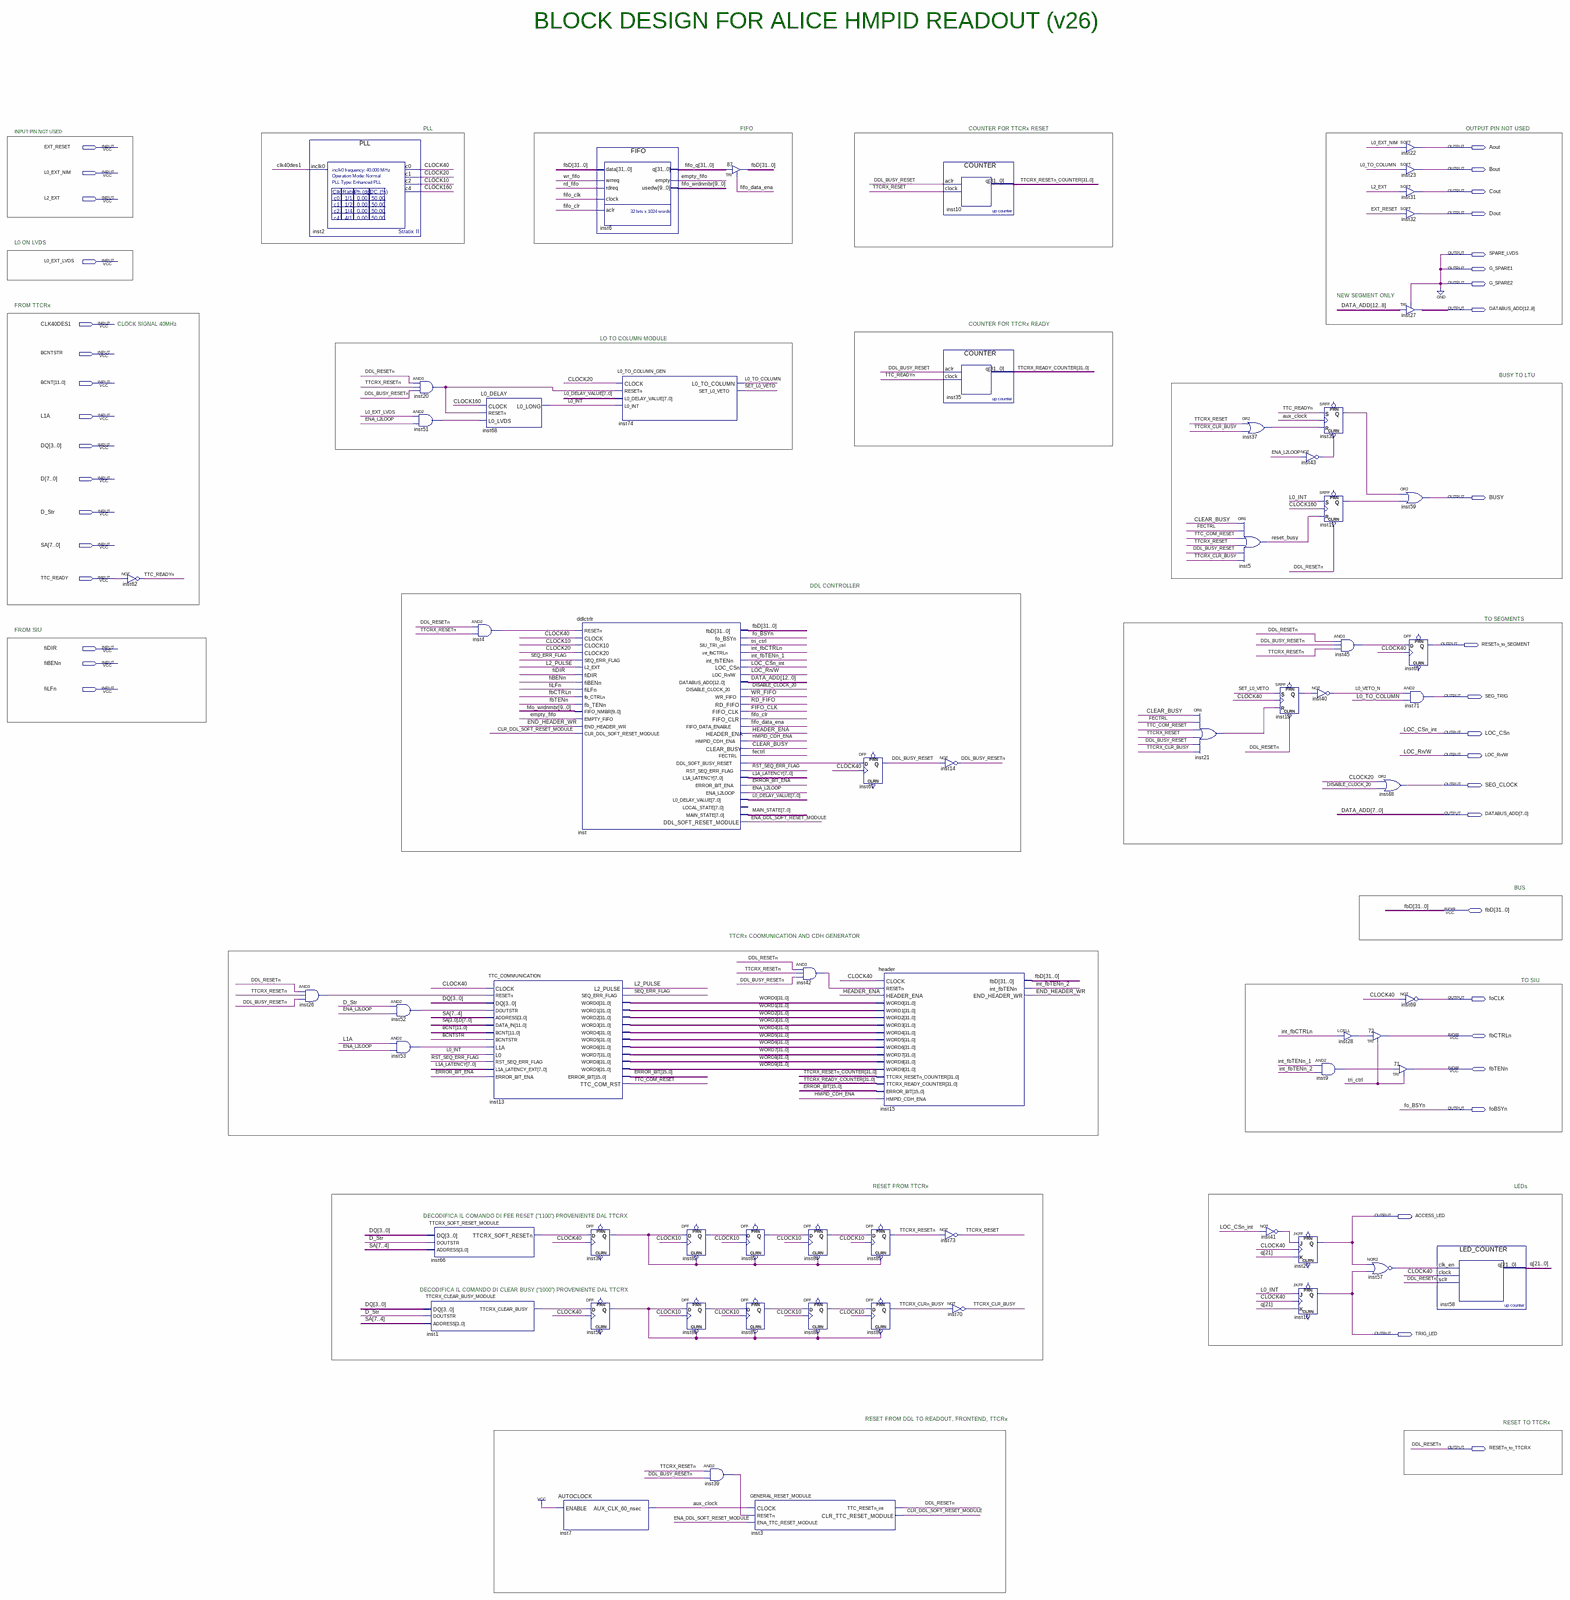
[diagram p0: schematic sheet, whole]
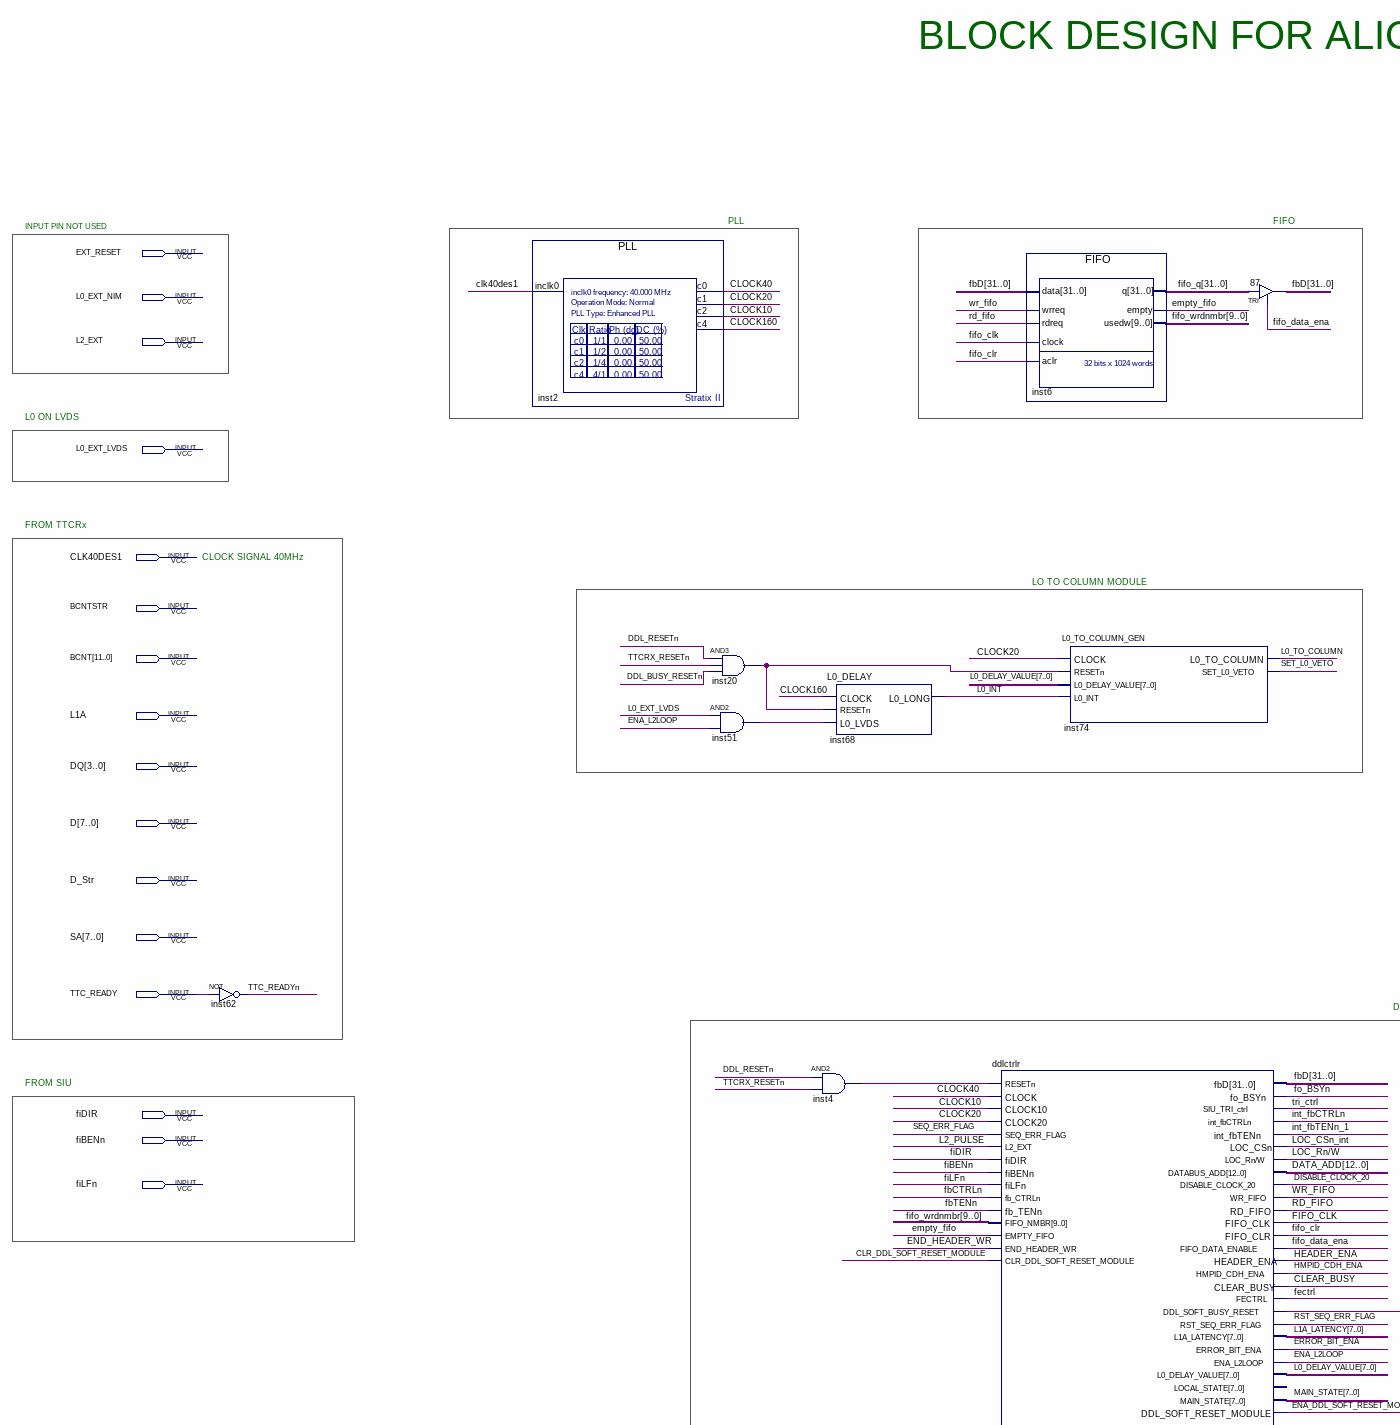
[diagram p1: schematic sheet, upper left part]
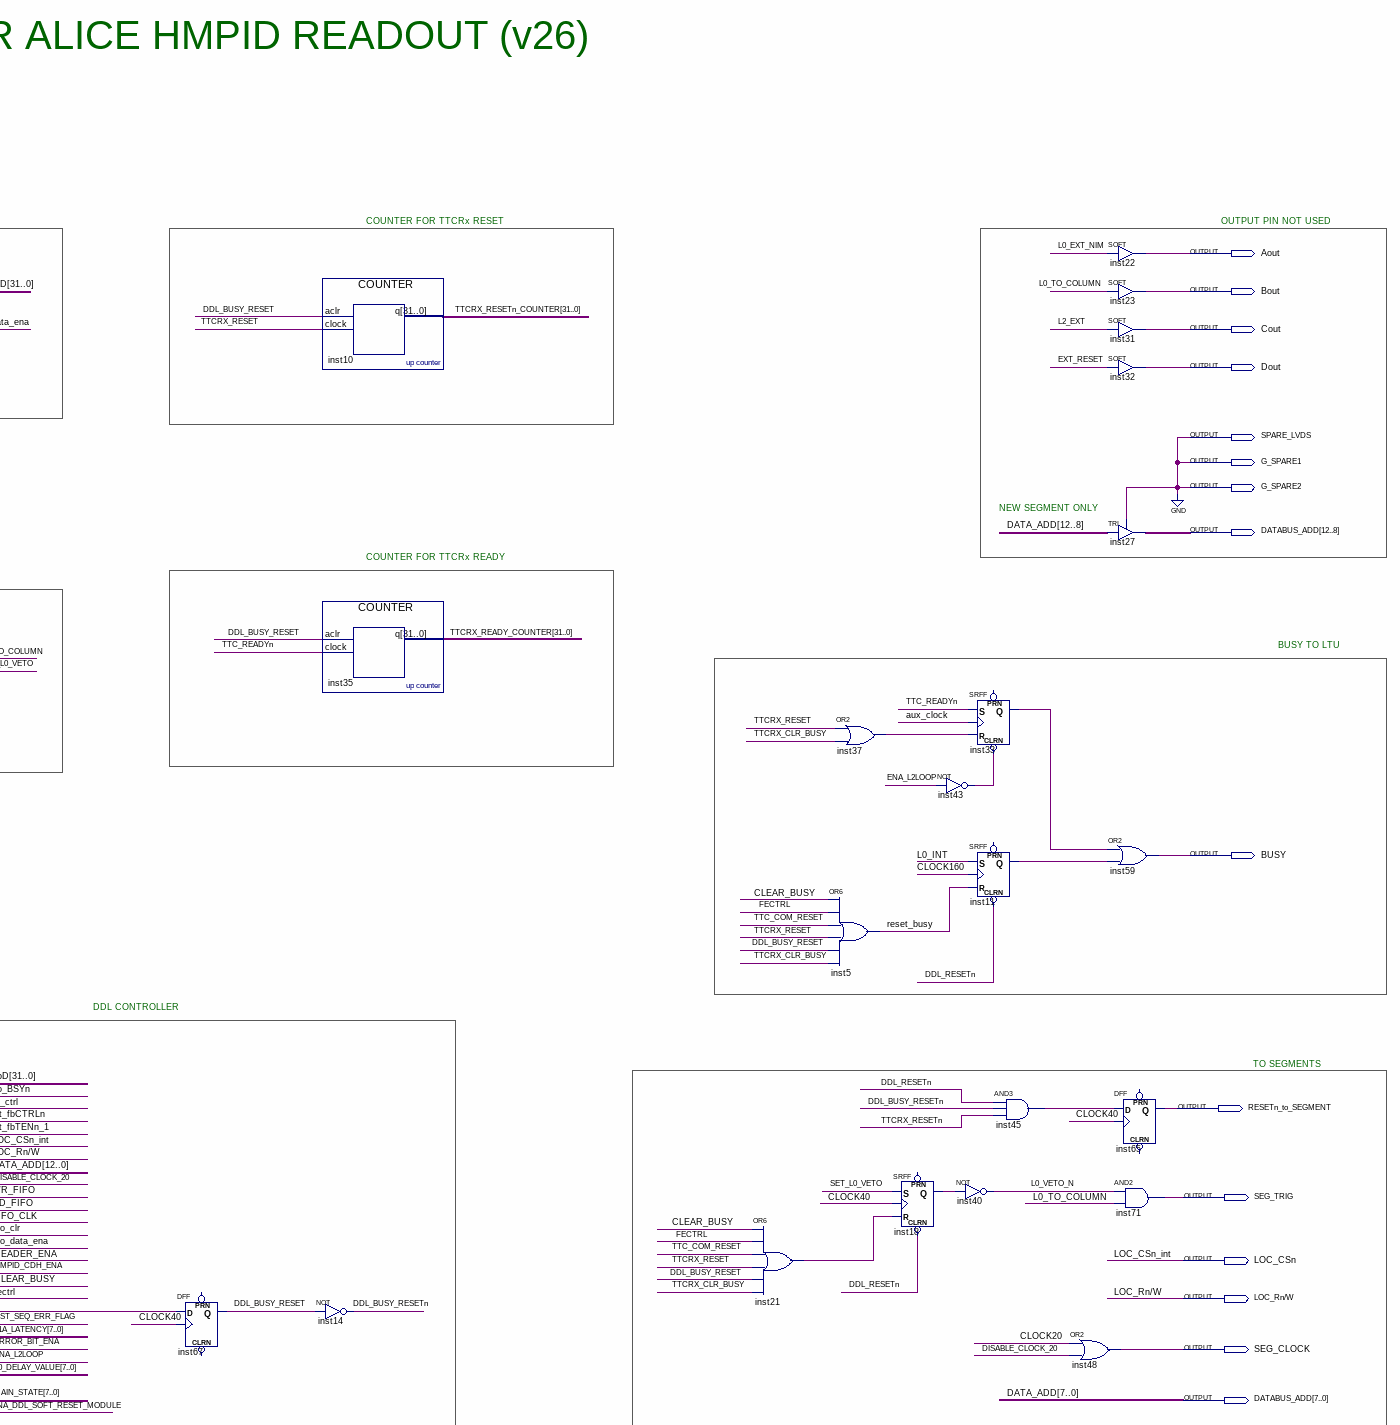
[diagram p2: schematic sheet, upper right part]
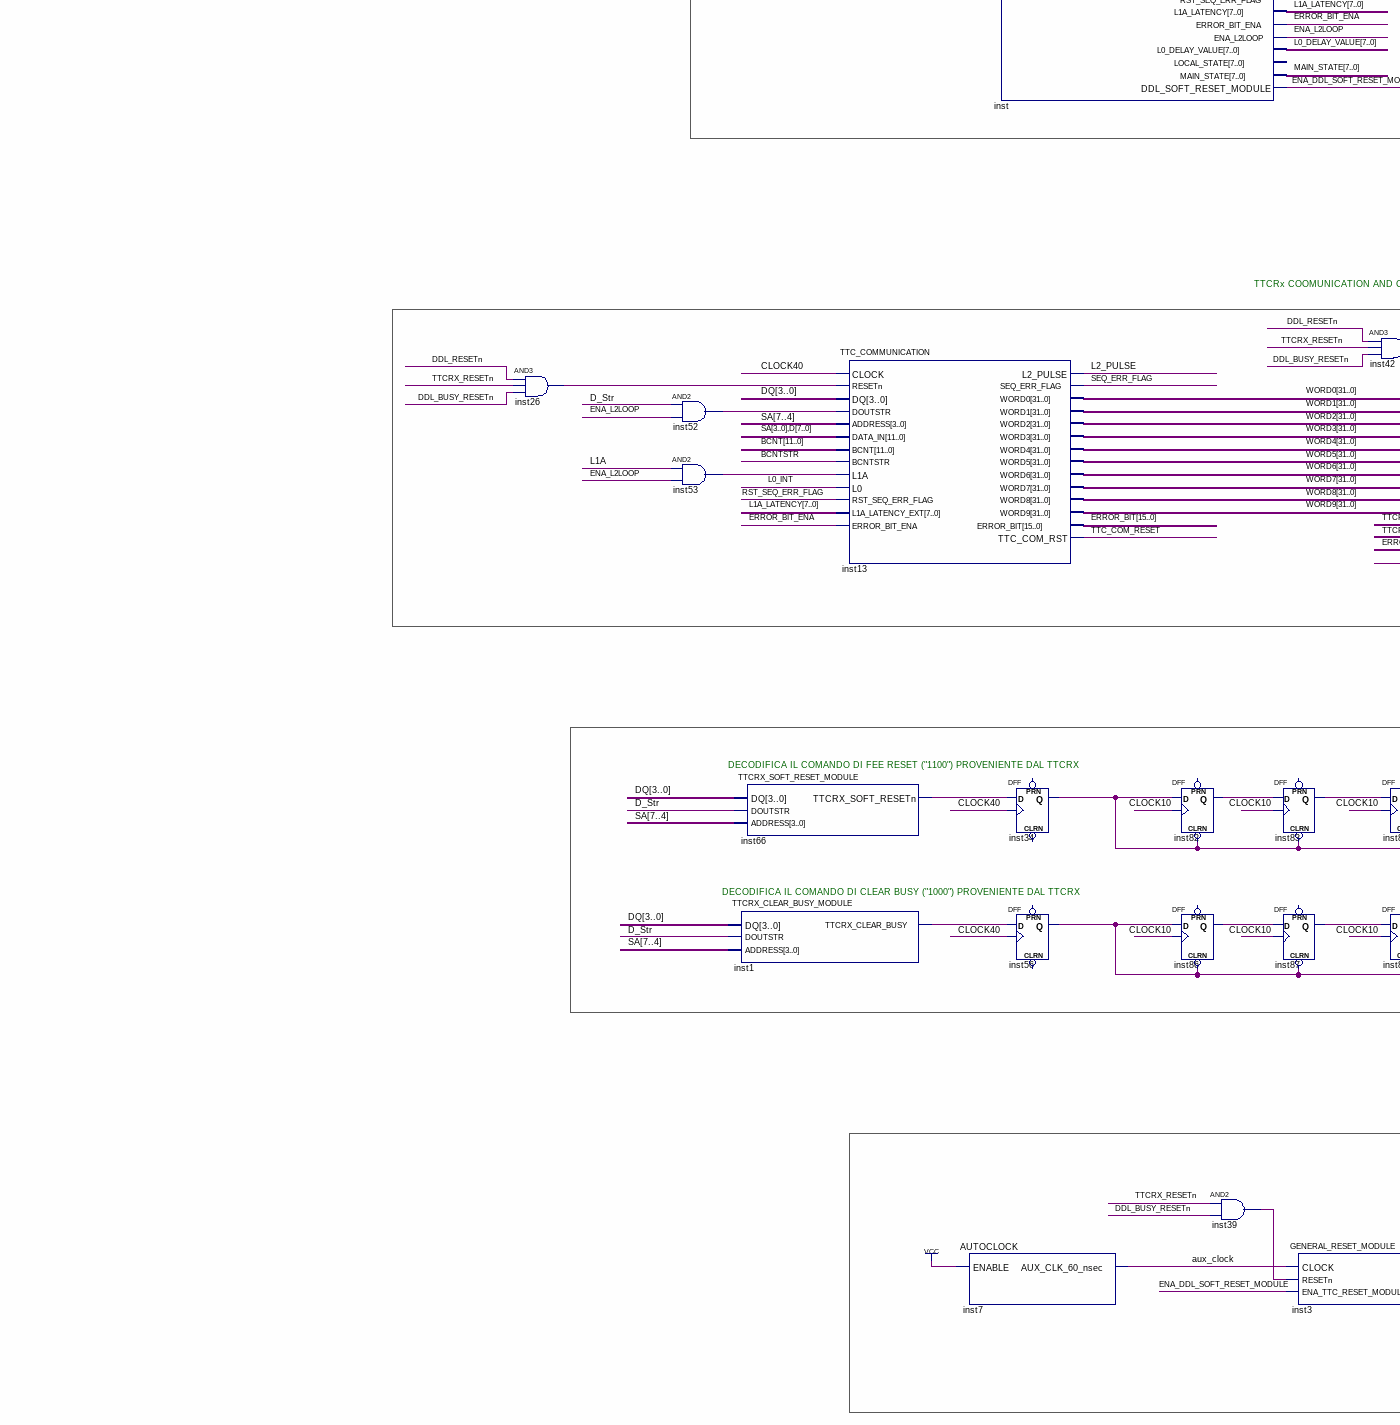
[diagram p3: schematic sheet, lower left part]
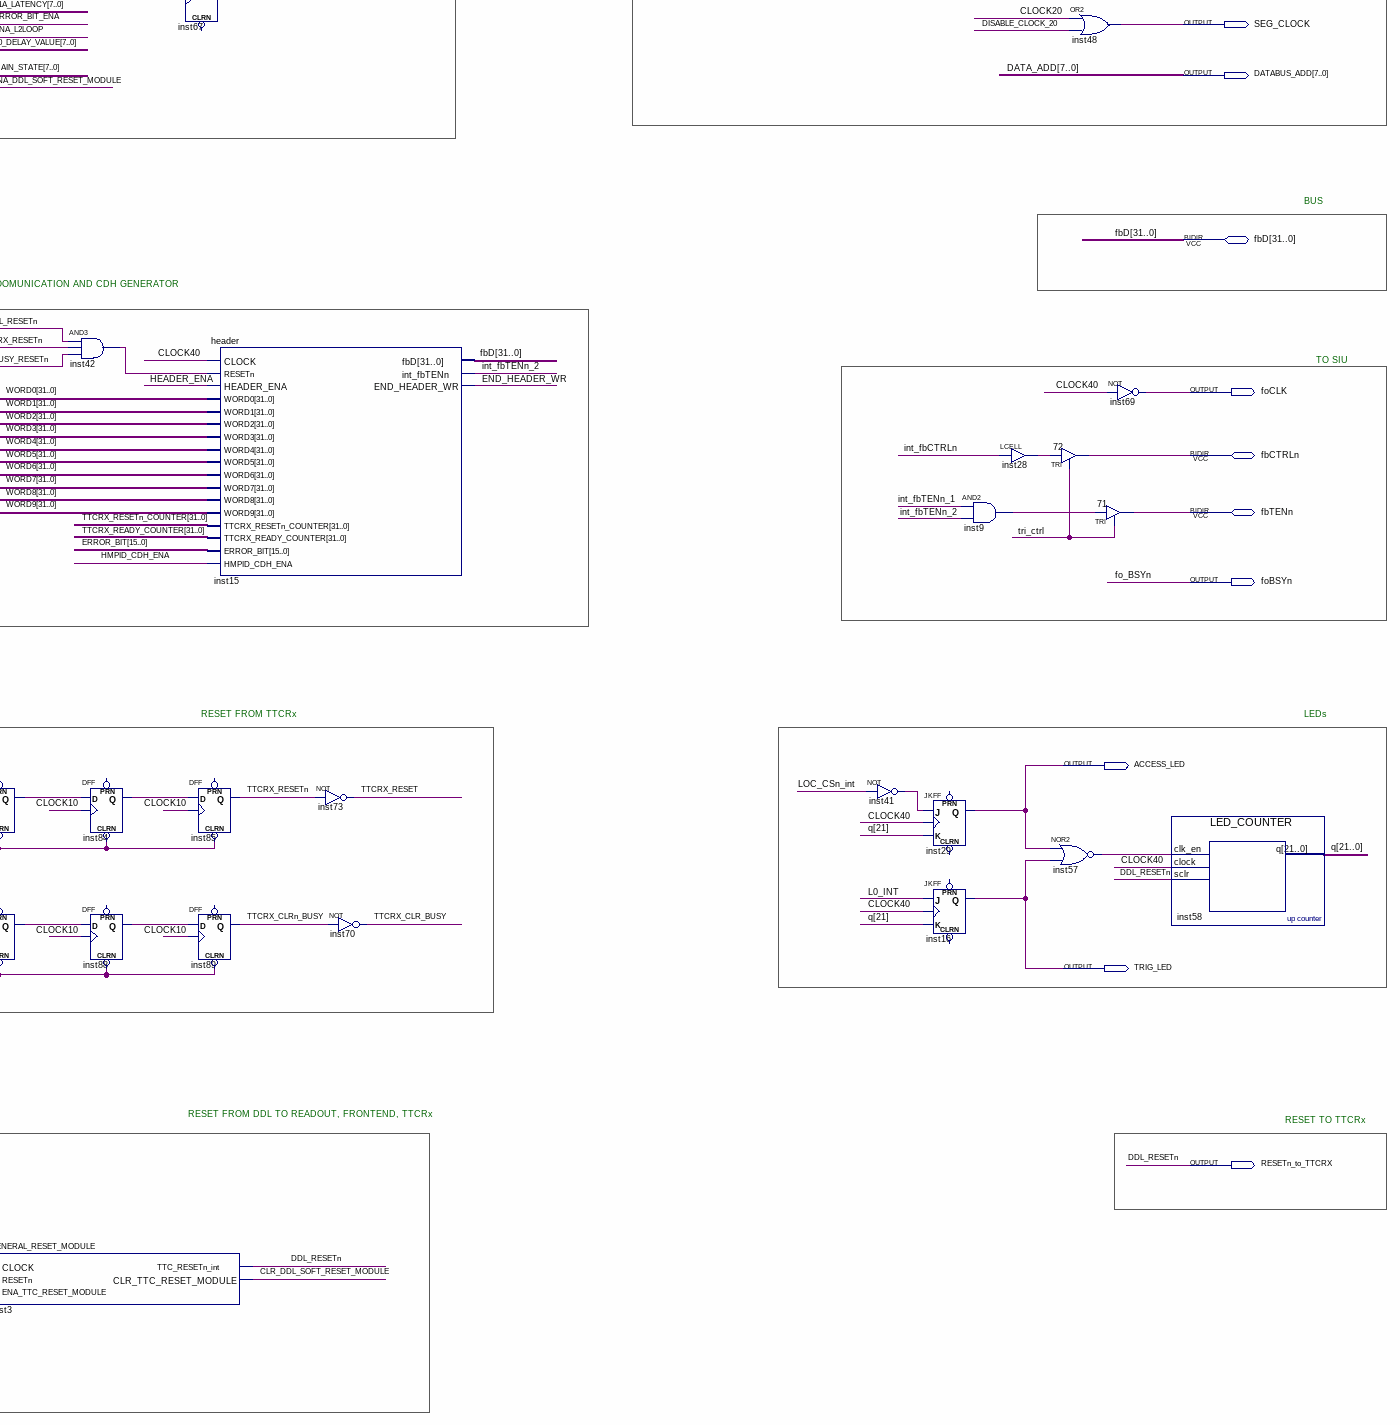
[diagram p4: schematic sheet, lower right part]
// Quartus schematic ddl_ctrlr.bdf as structural Verilog: 65 symbols, 39 pins
module ddl_ctrlr (
  input  EXT_RESET,
  input  L0_EXT_NIM,
  input  L2_EXT,
  input  L0_EXT_LVDS,
  input  CLK40DES1,
  input  BCNTSTR,
  input  [11:0] BCNT,
  input  L1A,
  input  [3:0] DQ,
  input  [7:0] D,
  input  D_Str,
  input  [7:0] SA,
  input  TTC_READY,
  input  fiDIR,
  input  fiBENn,
  input  fiLFn,
  inout  [31:0] fbD,
  inout  fbCTRLn,
  inout  fbTENn,
  output Aout,
  output Bout,
  output Cout,
  output Dout,
  output SPARE_LVDS,
  output G_SPARE1,
  output G_SPARE2,
  output [12:0] DATABUS_ADD,
  output BUSY,
  output RESETn_to_SEGMENT,
  output SEG_TRIG,
  output LOC_CSn,
  output \LOC_Rn/W ,
  output SEG_CLOCK,
  output foCLK,
  output foBSYn,
  output ACCESS_LED,
  output TRIG_LED,
  output RESETn_to_TTCRX
);

  wire aux_clock, CLEAR_BUSY, CLOCK10, CLOCK20, CLOCK40, CLOCK160, CLR_DDL_SOFT_RESET_MODULE, DDL_BUSY_RESET,
       DDL_BUSY_RESETn, DISABLE_CLOCK_20, empty_fifo, ENA_DDL_SOFT_RESET_MODULE, ENA_L2LOOP, END_HEADER_WR,
       ERROR_BIT_ENA, FECTRL, fifo_clk, fifo_clr, fifo_data_ena, HEADER_ENA, HMPID_CDH_ENA,
       inst1_ttcrx_clear_busy, inst4_out, inst9_out, inst11_q, inst18_q, inst20_out, inst21_out, inst26_out,
       inst28_out, inst33_q, inst34_q, inst37_out, inst39_out, inst41_out, inst42_out, inst43_out,
       inst45_out, inst51_out, inst52_out, inst53_out, inst56_q, inst57_out, inst66_ttcrx_soft_resetn,
       inst82_q, inst83_q, inst84_q, inst86_q, inst87_q, inst88_q, inst_ddl_soft_busy_reset, int_fbCTRLn,
       int_fbTENn_1, int_fbTENn_2, L0_INT, L0_TO_COLUMN, L0_VETO_N, L2_PULSE, rd_fifo, reset_busy,
       RST_SEQ_ERR_FLAG, SEQ_ERR_FLAG, SET_L0_VETO, tri_ctrl, TTC_COM_RESET, TTC_READYn, TTCRX_CLR_BUSY,
       TTCRX_CLRn_BUSY, TTCRX_RESET, TTCRX_RESETn, wr_fifo;
  wire [7:0] L0_DELAY_VALUE, L1A_LATENCY, MAIN_STATE;
  wire [9:0] fifo_wrdnmbr;
  wire [12:8] DATA_ADD;
  wire [15:0] ERROR_BIT;
  wire [21:0] q;
  wire [31:0] fifo_q, TTCRX_READY_COUNTER, TTCRX_RESETn_COUNTER, WORD0, WORD1, WORD2, WORD3, WORD4, WORD5,
       WORD6, WORD7, WORD8, WORD9;

  not inst62 (TTC_READYn, TTC_READY);
  PLL inst2 (.inclk0(CLK40DES1), .c0(CLOCK40), .c1(CLOCK20), .c2(CLOCK10), .c4(CLOCK160));
  and inst26 (inst26_out, RESETn_to_TTCRX, TTCRX_RESETn, DDL_BUSY_RESETn);
  and inst20 (inst20_out, RESETn_to_TTCRX, TTCRX_RESETn, DDL_BUSY_RESETn);
  and inst51 (inst51_out, L0_EXT_LVDS, ENA_L2LOOP);
  and inst52 (inst52_out, D_Str, ENA_L2LOOP);
  and inst53 (inst53_out, L1A, ENA_L2LOOP);
  TTCRX_SOFT_RESET_MODULE inst66 (
    .DQ(DQ), .DOUTSTR(D_Str), .ADDRESS(SA[7:4]), .TTCRX_SOFT_RESETn(inst66_ttcrx_soft_resetn));
  TTCRX_CLEAR_BUSY_MODULE inst1 (
    .DQ(DQ), .DOUTSTR(D_Str), .ADDRESS(SA[7:4]), .TTCRX_CLEAR_BUSY(inst1_ttcrx_clear_busy));
  and inst4 (inst4_out, RESETn_to_TTCRX, TTCRX_RESETn);
  L0_DELAY inst68 (.CLOCK(CLOCK160), .RESETn(inst20_out), .L0_LVDS(inst51_out), .L0_LONG(L0_INT));
  TTC_COMMUNICATION inst13 (
    .CLOCK(CLOCK40), .RESETn(inst26_out), .DQ(DQ), .DOUTSTR(inst52_out), .ADDRESS(SA[7:4]),
    .DATA_IN({SA[3:0], D}), .BCNT(BCNT), .BCNTSTR(BCNTSTR), .L1A(inst53_out), .L0(L0_INT),
    .RST_SEQ_ERR_FLAG(RST_SEQ_ERR_FLAG), .L1A_LATENCY_EXT(L1A_LATENCY), .ERROR_BIT_ENA(ERROR_BIT_ENA),
    .L2_PULSE(L2_PULSE), .SEQ_ERR_FLAG(SEQ_ERR_FLAG), .WORD0(WORD0), .WORD1(WORD1), .WORD2(WORD2),
    .WORD3(WORD3), .WORD4(WORD4), .WORD5(WORD5), .WORD6(WORD6), .WORD7(WORD7), .WORD8(WORD8), .WORD9(WORD9),
    .ERROR_BIT(ERROR_BIT), .TTC_COM_RST(TTC_COM_RESET));
  AUTOCLOCK inst7 (.ENABLE(1'b1), .AUX_CLK_60_nsec(aux_clock));
  ddlctrlr inst (
    .RESETn(inst4_out), .CLOCK(CLOCK40), .CLOCK10(CLOCK10), .CLOCK20(CLOCK20), .SEQ_ERR_FLAG(SEQ_ERR_FLAG),
    .L2_EXT(L2_PULSE), .fiDIR(fiDIR), .fiBENn(fiBENn), .fiLFn(fiLFn), .fb_CTRLn(fbCTRLn), .fb_TENn(fbTENn),
    .FIFO_NMBR(fifo_wrdnmbr), .EMPTY_FIFO(empty_fifo), .END_HEADER_WR(END_HEADER_WR),
    .CLR_DDL_SOFT_RESET_MODULE(CLR_DDL_SOFT_RESET_MODULE), .fo_BSYn(foBSYn), .SIU_TRI_ctrl(tri_ctrl),
    .int_fbCTRLn(int_fbCTRLn), .int_fbTENn(int_fbTENn_1), .LOC_CSn(LOC_CSn), .\LOC_Rn/W (\LOC_Rn/W ),
    .DATABUS_ADD({DATA_ADD, DATABUS_ADD[7:0]}), .DISABLE_CLOCK_20(DISABLE_CLOCK_20), .WR_FIFO(wr_fifo),
    .RD_FIFO(rd_fifo), .FIFO_CLK(fifo_clk), .FIFO_CLR(fifo_clr), .FIFO_DATA_ENABLE(fifo_data_ena),
    .HEADER_ENA(HEADER_ENA), .HMPID_CDH_ENA(HMPID_CDH_ENA), .CLEAR_BUSY(CLEAR_BUSY), .FECTRL(FECTRL),
    .DDL_SOFT_BUSY_RESET(inst_ddl_soft_busy_reset), .RST_SEQ_ERR_FLAG(RST_SEQ_ERR_FLAG),
    .L1A_LATENCY(L1A_LATENCY), .ERROR_BIT_ENA(ERROR_BIT_ENA), .ENA_L2LOOP(ENA_L2LOOP),
    .L0_DELAY_VALUE(L0_DELAY_VALUE), .MAIN_STATE(MAIN_STATE),
    .DDL_SOFT_RESET_MODULE(ENA_DDL_SOFT_RESET_MODULE), .fbD(fbD));  // open: LOCAL_STATE
  DFF inst34 (.CLK(CLOCK40), .D(inst66_ttcrx_soft_resetn), .Q(inst34_q));  // open: CLRN, PRN
  DFF inst56 (.CLK(CLOCK40), .D(inst1_ttcrx_clear_busy), .Q(inst56_q));  // open: CLRN, PRN
  FIFO inst6 (
    .data(fbD), .wrreq(wr_fifo), .rdreq(rd_fifo), .clock(fifo_clk), .aclr(fifo_clr), .q(fifo_q),
    .empty(empty_fifo), .usedw(fifo_wrdnmbr));
  L0_TO_COLUMN_GEN inst74 (
    .CLOCK(CLOCK20), .RESETn(inst20_out), .L0_DELAY_VALUE(L0_DELAY_VALUE), .L0_INT(L0_INT),
    .L0_TO_COLUMN(L0_TO_COLUMN), .SET_L0_VETO(SET_L0_VETO));
  DFF inst82 (.CLRN(inst34_q), .CLK(CLOCK10), .D(inst34_q), .Q(inst82_q));  // open: PRN
  DFF inst86 (.CLRN(inst56_q), .CLK(CLOCK10), .D(inst56_q), .Q(inst86_q));  // open: PRN
  and inst39 (inst39_out, TTCRX_RESETn, DDL_BUSY_RESETn);
  TRI u_87[31:0] (.IN(fifo_q), .OE(fifo_data_ena), .OUT(fbD));
  DFF inst83 (.CLRN(inst34_q), .CLK(CLOCK10), .D(inst82_q), .Q(inst83_q));  // open: PRN
  DFF inst87 (.CLRN(inst56_q), .CLK(CLOCK10), .D(inst86_q), .Q(inst87_q));  // open: PRN
  GENERAL_RESET_MODULE inst3 (
    .CLOCK(aux_clock), .RESETn(inst39_out), .ENA_TTC_RESET_MODULE(ENA_DDL_SOFT_RESET_MODULE),
    .TTC_RESETn_int(RESETn_to_TTCRX), .CLR_TTC_RESET_MODULE(CLR_DDL_SOFT_RESET_MODULE));
  and inst42 (inst42_out, RESETn_to_TTCRX, TTCRX_RESETn, DDL_BUSY_RESETn);
  DFF inst84 (.CLRN(inst34_q), .CLK(CLOCK10), .D(inst83_q), .Q(inst84_q));  // open: PRN
  DFF inst88 (.CLRN(inst56_q), .CLK(CLOCK10), .D(inst87_q), .Q(inst88_q));  // open: PRN
  DFF inst67 (.CLK(CLOCK40), .D(inst_ddl_soft_busy_reset), .Q(DDL_BUSY_RESET));  // open: CLRN, PRN
  header inst15 (
    .CLOCK(CLOCK40), .RESETn(inst42_out), .HEADER_ENA(HEADER_ENA), .WORD0(WORD0), .WORD1(WORD1),
    .WORD2(WORD2), .WORD3(WORD3), .WORD4(WORD4), .WORD5(WORD5), .WORD6(WORD6), .WORD7(WORD7), .WORD8(WORD8),
    .WORD9(WORD9), .TTCRX_RESETn_COUNTER(TTCRX_RESETn_COUNTER), .TTCRX_READY_COUNTER(TTCRX_READY_COUNTER),
    .ERROR_BIT(ERROR_BIT), .HMPID_CDH_ENA(HMPID_CDH_ENA), .int_fbTENn(int_fbTENn_2),
    .END_HEADER_WR(END_HEADER_WR), .fbD(fbD));
  DFF inst85 (.CLRN(inst34_q), .CLK(CLOCK10), .D(inst84_q), .Q(TTCRX_RESETn));  // open: PRN
  DFF inst89 (.CLRN(inst56_q), .CLK(CLOCK10), .D(inst88_q), .Q(TTCRX_CLRn_BUSY));  // open: PRN
  COUNTER inst10 (.aclr(DDL_BUSY_RESET), .clock(TTCRX_RESET), .q(TTCRX_RESETn_COUNTER));
  COUNTER inst35 (.aclr(DDL_BUSY_RESET), .clock(TTC_READYn), .q(TTCRX_READY_COUNTER));
  not inst14 (DDL_BUSY_RESETn, DDL_BUSY_RESET);
  not inst73 (TTCRX_RESET, TTCRX_RESETn);
  not inst70 (TTCRX_CLR_BUSY, TTCRX_CLRn_BUSY);
  or inst21 (inst21_out, CLEAR_BUSY, FECTRL, TTC_COM_RESET, TTCRX_RESET, DDL_BUSY_RESET, TTCRX_CLR_BUSY);
  or inst5 (reset_busy, CLEAR_BUSY, FECTRL, TTC_COM_RESET, TTCRX_RESET, DDL_BUSY_RESET, TTCRX_CLR_BUSY);
  or inst37 (inst37_out, TTCRX_RESET, TTCRX_CLR_BUSY);
  not inst41 (inst41_out, LOC_CSn);
  SRFF inst18 (.CLRN(RESETn_to_TTCRX), .S(SET_L0_VETO), .R(inst21_out), .CLK(CLOCK40), .Q(inst18_q));  // open: PRN
  JKFF inst29 (.K(q[21]), .J(inst41_out), .CLK(CLOCK40), .Q(ACCESS_LED));  // open: PRN, CLRN
  JKFF inst16 (.K(q[21]), .J(L0_INT), .CLK(CLOCK40), .Q(TRIG_LED));  // open: PRN, CLRN
  SRFF inst33 (.CLRN(inst43_out), .S(TTC_READYn), .R(inst37_out), .CLK(aux_clock), .Q(inst33_q));  // open: PRN
  not inst43 (inst43_out, ENA_L2LOOP);
  SRFF inst11 (.CLRN(RESETn_to_TTCRX), .S(L0_INT), .R(reset_busy), .CLK(CLOCK160), .Q(inst11_q));  // open: PRN
  not inst40 (L0_VETO_N, inst18_q);
  and inst9 (inst9_out, int_fbTENn_1, int_fbTENn_2);
  and inst45 (inst45_out, RESETn_to_TTCRX, DDL_BUSY_RESETn, TTCRX_RESETn);
  LCELL inst28 (.IN(int_fbCTRLn), .OUT(inst28_out));
  or inst48 (SEG_CLOCK, CLOCK20, DISABLE_CLOCK_20);
  TRI u_72 (.IN(inst28_out), .OE(tri_ctrl), .OUT(fbCTRLn));
  nor inst57 (inst57_out, ACCESS_LED, TRIG_LED);
  SOFT inst22 (.IN(L0_EXT_NIM), .OUT(Aout));
  SOFT inst23 (.IN(L0_TO_COLUMN), .OUT(Bout));
  SOFT inst31 (.IN(L2_EXT), .OUT(Cout));
  SOFT inst32 (.IN(EXT_RESET), .OUT(Dout));
  TRI inst27[4:0] (.IN(DATA_ADD), .OE(1'b0), .OUT(DATABUS_ADD[12:8]));
  or inst59 (BUSY, inst33_q, inst11_q);
  DFF inst65 (.CLK(CLOCK40), .D(inst45_out), .Q(RESETn_to_SEGMENT));  // open: CLRN, PRN
  and inst71 (SEG_TRIG, L0_VETO_N, L0_TO_COLUMN);
  not inst69 (foCLK, CLOCK40);
  TRI u_71 (.IN(inst9_out), .OE(tri_ctrl), .OUT(fbTENn));
  LED_COUNTER inst58 (.clk_en(inst57_out), .clock(CLOCK40), .sclr(RESETn_to_TTCRX), .q(q));

  assign G_SPARE1 = 1'b0;
  assign G_SPARE2 = 1'b0;
  assign SPARE_LVDS = 1'b0;

  // Other names for the same wires on the sheet: DATA_ADD[7:0] = DATABUS_ADD[7:0]; DDL_RESETn = RESETn_to_TTCRX;
  //   fo_BSYn = foBSYn; LOC_CSn_int = LOC_CSn

  // Notes on the sheet:
  //   BLOCK DESIGN FOR ALICE HMPID READOUT (v26)
  //   PLL
  //   FIFO
  //   COUNTER FOR TTCRx RESET
  //   OUTPUT PIN NOT USED
  //   INPUT PIN NOT USED
  //   L0 ON LVDS
  //   NEW SEGMENT ONLY
  //     FROM TTCRx
  //   CLOCK SIGNAL 40MHz
  //   COUNTER FOR TTCRx READY
  //   LO TO COLUMN MODULE
  //   BUSY TO LTU
  //   DDL CONTROLLER
  //   TO SEGMENTS
  //   FROM SIU
  //   BUS 
  //   TTCRx COOMUNICATION AND CDH GENERATOR
  //   TO SIU
  //   RESET FROM TTCRx
  //   LEDs
  //   DECODIFICA IL COMANDO DI FEE RESET ("1100") PROVENIENTE DAL TTCRX
  //   DECODIFICA IL COMANDO DI CLEAR BUSY ("1000") PROVENIENTE DAL TTCRX
  //   RESET FROM DDL TO READOUT, FRONTEND, TTCRx
  //   RESET TO TTCRx
endmodule
